# EAGLE design 4x4_numpad (EAGLE 8.2.2)
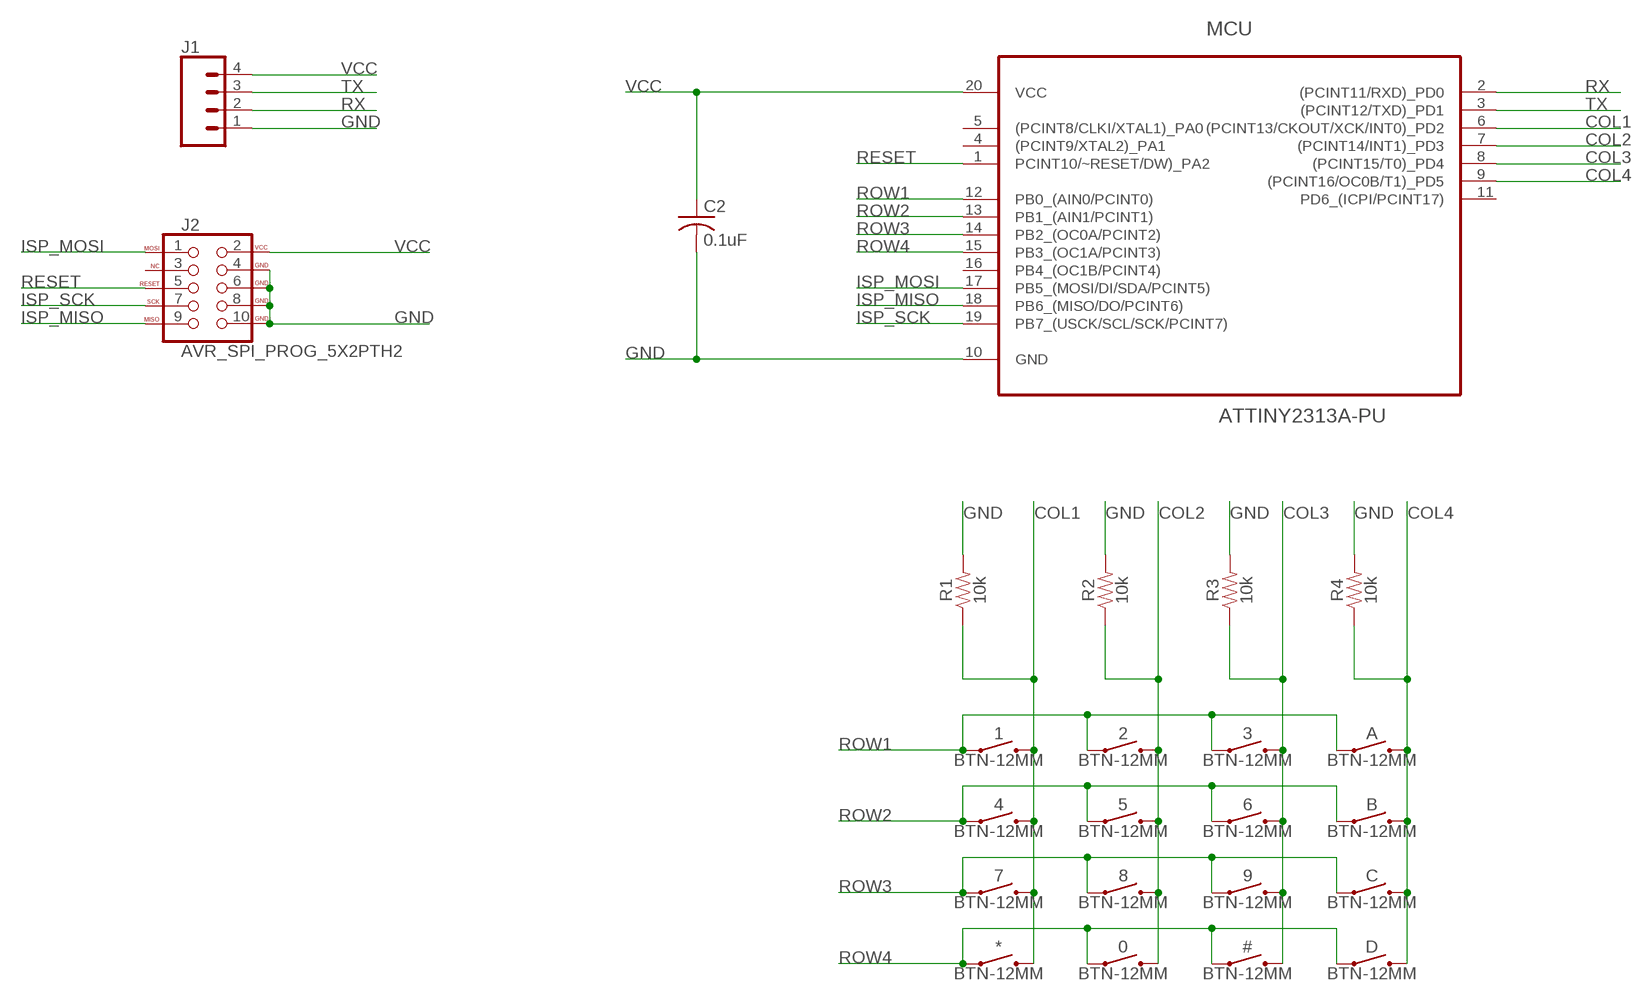
[diagram p0: schematic, sheet 1]

## Parts
0  BTN-12MM  MOMENTARY-SWITCH-SPST-PTH-12MM  [TACTILE_SWITCH_PTH_12MM]
1  BTN-12MM  MOMENTARY-SWITCH-SPST-PTH-12MM  [TACTILE_SWITCH_PTH_12MM]
2  BTN-12MM  MOMENTARY-SWITCH-SPST-PTH-12MM  [TACTILE_SWITCH_PTH_12MM]
3  BTN-12MM  MOMENTARY-SWITCH-SPST-PTH-12MM  [TACTILE_SWITCH_PTH_12MM]
4  BTN-12MM  MOMENTARY-SWITCH-SPST-PTH-12MM  [TACTILE_SWITCH_PTH_12MM]
5  BTN-12MM  MOMENTARY-SWITCH-SPST-PTH-12MM  [TACTILE_SWITCH_PTH_12MM]
6  BTN-12MM  MOMENTARY-SWITCH-SPST-PTH-12MM  [TACTILE_SWITCH_PTH_12MM]
7  BTN-12MM  MOMENTARY-SWITCH-SPST-PTH-12MM  [TACTILE_SWITCH_PTH_12MM]
8  BTN-12MM  MOMENTARY-SWITCH-SPST-PTH-12MM  [TACTILE_SWITCH_PTH_12MM]
9  BTN-12MM  MOMENTARY-SWITCH-SPST-PTH-12MM  [TACTILE_SWITCH_PTH_12MM]
#  BTN-12MM  MOMENTARY-SWITCH-SPST-PTH-12MM  [TACTILE_SWITCH_PTH_12MM]
*  BTN-12MM  MOMENTARY-SWITCH-SPST-PTH-12MM  [TACTILE_SWITCH_PTH_12MM]
A  BTN-12MM  MOMENTARY-SWITCH-SPST-PTH-12MM  [TACTILE_SWITCH_PTH_12MM]
B  BTN-12MM  MOMENTARY-SWITCH-SPST-PTH-12MM  [TACTILE_SWITCH_PTH_12MM]
C  BTN-12MM  MOMENTARY-SWITCH-SPST-PTH-12MM  [TACTILE_SWITCH_PTH_12MM]
C2  0.1uF  C-US050-025X075  [C050-025X075]
D  BTN-12MM  MOMENTARY-SWITCH-SPST-PTH-12MM  [TACTILE_SWITCH_PTH_12MM]
J1  CONN_04  [1X04]
J2  AVR_SPI_PROG_5X2PTH2  [2X5-SHROUDED]
MCU  ATTINY2313A-PU  [DIP254P762X533-20]
R1  10k  10KOHM-HORIZ-1/4W-1%  [AXIAL-0.3]
R2  10k  10KOHM-HORIZ-1/4W-1%  [AXIAL-0.3]
R3  10k  10KOHM-HORIZ-1/4W-1%  [AXIAL-0.3]
R4  10k  10KOHM-HORIZ-1/4W-1%  [AXIAL-0.3]

## Nets
COL1: 1.3 1.4 4.3 4.4 7.3 7.4 *.3 *.4 MCU.6((PCINT13/CKOUT/XCK/INT0)_PD2) R1.P$1
COL2: 0.3 0.4 2.3 2.4 5.3 5.4 8.3 8.4 MCU.7((PCINT14/INT1)_PD3) R2.P$1
COL3: 3.3 3.4 6.3 6.4 9.3 9.4 #.3 #.4 MCU.8((PCINT15/T0)_PD4) R3.P$1
COL4: A.3 A.4 B.3 B.4 C.3 C.4 D.3 D.4 MCU.9((PCINT16/OC0B/T1)_PD5) R4.P$1
GND: C2.2 J1.1 J2.4(GND) J2.6(GND) J2.8(GND) J2.10(GND) MCU.10(GND) R1.P$2 R2.P$2 R3.P$2 R4.P$2
ISP_MISO: J2.9(MISO) MCU.18(PB6_(MISO/DO/PCINT6))
ISP_MOSI: J2.1(MOSI) MCU.17(PB5_(MOSI/DI/SDA/PCINT5))
ISP_SCK: J2.7(SCK) MCU.19(PB7_(USCK/SCL/SCK/PCINT7))
RESET: J2.5(RESET) MCU.1(PCINT10/~RESET/DW)_PA2)
ROW1: 1.1 1.2 2.1 2.2 3.1 3.2 A.1 A.2 MCU.12(PB0_(AIN0/PCINT0))
ROW2: 4.1 4.2 5.1 5.2 6.1 6.2 B.1 B.2 MCU.13(PB1_(AIN1/PCINT1))
ROW3: 7.1 7.2 8.1 8.2 9.1 9.2 C.1 C.2 MCU.14(PB2_(OC0A/PCINT2))
ROW4: 0.1 0.2 #.1 #.2 *.1 *.2 D.1 D.2 MCU.15(PB3_(OC1A/PCINT3))
RX: J1.2 MCU.2((PCINT11/RXD)_PD0)
TX: J1.3 MCU.3((PCINT12/TXD)_PD1)
VCC: C2.1 J1.4 J2.2(VCC) MCU.20(VCC)
Unconnected: J2.3(NC) MCU.4((PCINT9/XTAL2)_PA1) MCU.5((PCINT8/CLKI/XTAL1)_PA0) MCU.11(PD6_(ICPI/PCINT17)) MCU.16(PB4_(OC1B/PCINT4))

## Library data of the parts
0 1-9 # * A B C D = SparkFun-Switches:MOMENTARY-SWITCH-SPST: Momentary Switch (Pushbutton) - SPST Normally-open (NO) SPST momentary switches (buttons, pushbuttons). Variants PTH-12MM - 12mm square, through-hole Momentary Pushbutton Switch - 12mm Square <https://www.sparkfun.com/products/9190> (COM-09190) PTH-6.0MM, PTH-6.0MM-KIT - 6.0mm square, through-hole Mini Pushbutton Switch <https://www.sparkfun.com/products/97> (COM-00097) KIT package intended for soldering kit's - only one side of pads' copper is exposed. PTH-RIGHT-ANGLE-KIT - Right-angle, through-hole Right Angle Tactile Button <https://www.sparkfun.com/products/10791> - Used on SparkFun BigTime Watch Kit <https://www.sparkfun.com/products/11734> SMD-12MM - 12mm square, surface-mount Tactile Button - SMD (12mm) <https://www.sparkfun.com/products/12993> (COM-12993) Used on SparkFun PicoBoard <https://www.sparkfun.com/products/11888> SMD-4.5MM - 4.5mm Square Trackball Switch Used on SparkFun Blackberry Trackballer Breakout <https://www.sparkfun.com/products/13169> SMD-4.6MMX2.8MM - 4.60mm x 2.80mm, surface mount Used on SparkFun SAMD21 Mini Breakout <https://www.sparkfun.com/products/13664> SMD-5.2MM, SMD-5.2-REDUNDANT - 5.2mm square, surface-mount Mini Pushbutton Switch - SMD <https://www.sparkfun.com/products/8720> (COM-08720) Used on Arduino Pro Mini <https://www.sparkfun.com/products/11114> REDUNDANT package connects both switch circuits together SMD-6.0X3.5MM - 6.0 x 3.5mm, surface mount Momentary Reset Switch SMD <https://www.sparkfun.com/products/8229> (COM-08229) SMD-6.2MM-TALL - 6.2mm square, surface mount Tactile Button - SMD (6mm) <https://www.sparkfun.com/products/12992> Used on SparkFun Digital Sandbox <https://www.sparkfun.com/products/12651> SMD-RIGHT-ANGLE - Right-angle, surface mount Used on SparkFun Block for Intel® Edison - Arduino <https://www.sparkfun.com/products/13036>; PROD_ID: SWCH-09185; SF_SKU: COM-09190
C2 = resistor:C-US: CAPACITOR, American symbol
J1 = SparkFun-Connectors:CONN_04: Multi connection point. Often used as Generic Header-pin footprint for 0.1 inch spaced/style header connections On any of the 0.1 inch spaced packages, you can populate with these: Break Away Headers - Straight <https://www.sparkfun.com/products/116> (PRT-00116) Break Away Male Headers - Right Angle <https://www.sparkfun.com/products/553> (PRT-00553) Female Headers <https://www.sparkfun.com/products/115> (PRT-00115) Break Away Headers - Machine Pin <https://www.sparkfun.com/products/117> (PRT-00117) Break Away Female Headers - Swiss Machine Pin <https://www.sparkfun.com/products/743> (PRT-00743) For SCREWTERMINALS and SPRING TERMINALS visit here: Screw Terimnals on SparkFun.com <https://www.sparkfun.com/search/results?term=Screw+Terminals> (5mm/3.5mm/2.54mm spacing) This device is also useful as a general connection point to wire up your design to another part of your project. Our various solder wires solder well into these plated through hole pads. Hook-Up Wire - Assortment (Stranded, 22 AWG) <https://www.sparkfun.com/products/11375> (PRT-11375) Hook-Up Wire - Assortment (Solid Core, 22 AWG) <https://www.sparkfun.com/products/11367> (PRT-11367) View the entire wire category on our website here <https://www.sparkfun.com/categories/141> Special notes: Molex polarized connector foot print use with SKU : PRT-08231 with associated crimp pins and housings. 1MM SMD Version SKU: PRT-10208; PROD_ID: CONN-09696
J2 = SparkFun-Connectors:AVR_SPI_PROG_5X2: AVR 10-pin ICSP Header This is the standard AVR In Circuit Serial Programming header. Minimal, but includes pin one indicator. Works with standard Olimex programmers. SparkFun Products: 2x5 AVR ICSP Male Header <https://www.sparkfun.com/products/778> - PTH 2x5 Pin Shrouded Header <https://www.sparkfun.com/products/8506> - PTH2; PROD_ID: CONN-08671; SF_ID: PRT-08506
MCU = Atmel_By_element14_Batch_1-00:ATTINY2313A-PU: 8-bit Microcontroller; DESCRIPTION: 8-bit Microcontroller; MPN: ATTINY2313A-PU; OC_FARNELL: 1841616; OC_NEWARK: 12T1333; PACKAGE: DIP-20; SUPPLIER: Atmel
R1-R4 = SparkFun-Resistors:10KOHM: 10kΩ resistor A resistor is a passive two-terminal electrical component that implements electrical resistance as a circuit element. Resistors act to reduce current flow, and, at the same time, act to lower voltage levels within circuits. - Wikipedia; PROD_ID: RES-12183

## Board
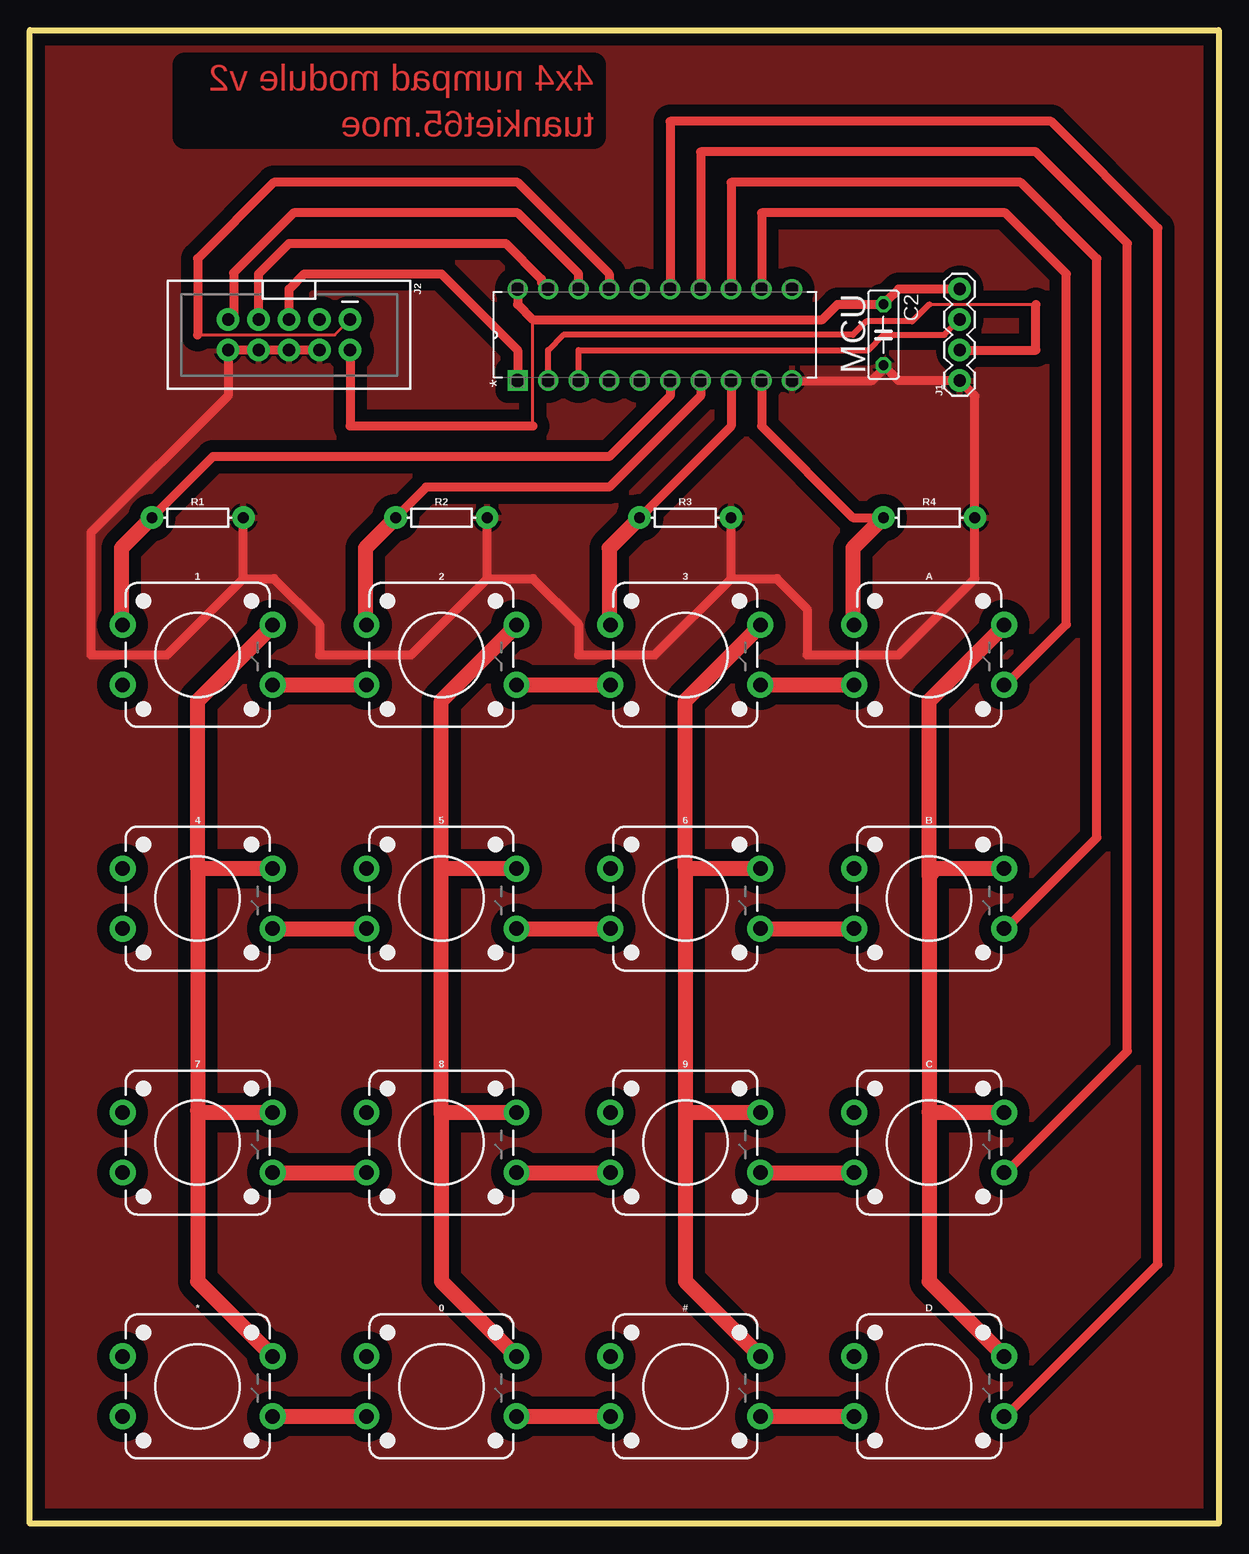
[diagram p1: board, top side]
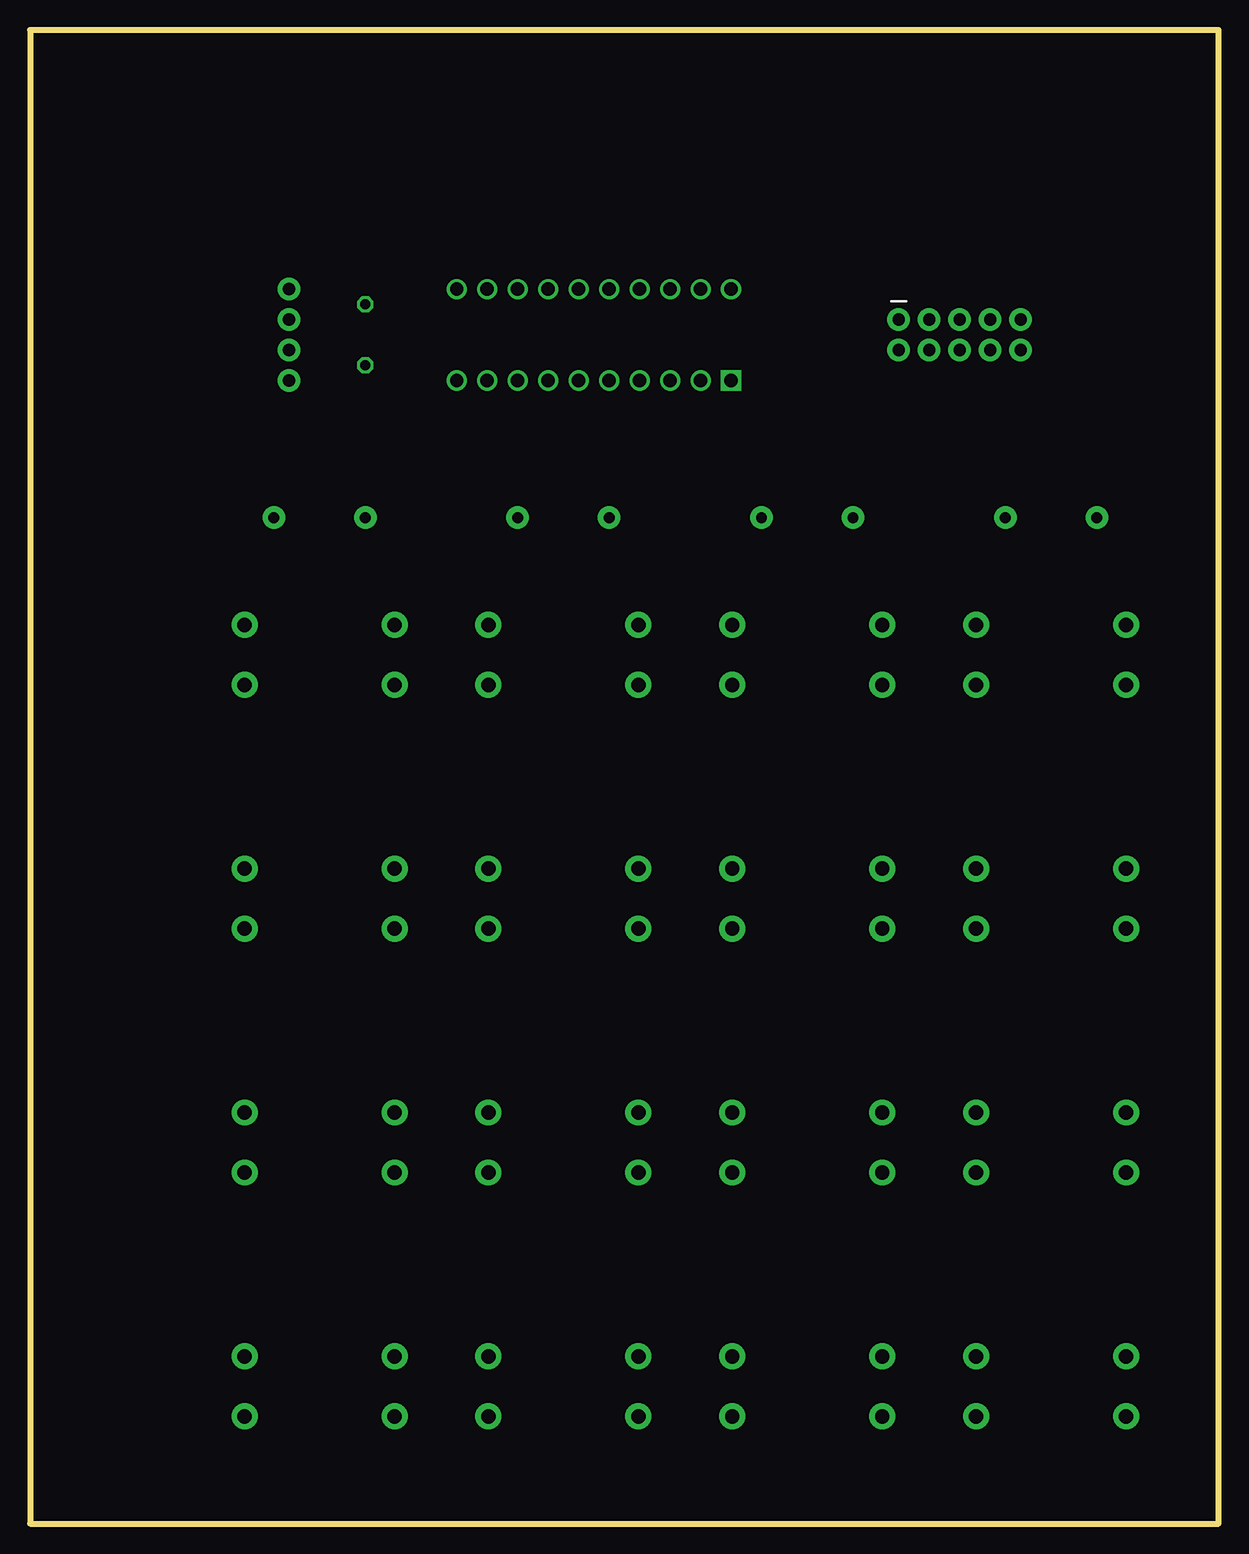
[diagram p2: board, bottom side, seen from below]

Size 99.06 x 124.46 mm. Coordinates in mm from the lower left corner, seen from the top.
Outline: 99.06,124.46 99.06,0 0,0 0,124.46 99.06,124.46
Copper layers (1*16): Top 0.035mm / dielectric 1.5mm / Bottom 0.035mm
Design rules "default *": minimum track width 20mil, minimum drill 0.35mm, track to track 20mil, track to pad 20mil, pad to pad 20mil, via to via 6mil, smd to smd 6mil, copper to edge 40mil, drill to drill 6mil, minimum pad ring 10mil, minimum via ring 8mil, stop-mask expansion 4mil, vias tented up to drill 0mil, thermal gap 10mil

### Footprints (pad centres in the part's own frame; a part is rotated, then mirrored left to right if it is on the bottom)
TACTILE_SWITCH_PTH_12MM = drill 1.2 pad 2.159: 1 6.25,-2.5; 2 -6.25,-2.5; 3 6.25,2.5; 4 -6.25,2.5
C050-025X075 = drill 0.813 octagon: 1 -2.54,0; 2 2.54,0
1X04 = drill 1.016 pad 1.88: 1 0,0; 2 2.54,0; 3 5.08,0; 4 7.62,0
2X5-SHROUDED = drill 1.016 pad 1.88: 1 -1.27,5.08; 2 1.27,5.08; 3 -1.27,2.54; 4 1.27,2.54; 5 -1.27,0; 6 1.27,0; 7 -1.27,-2.54; 8 1.27,-2.54; 9 -1.27,-5.08; 10 1.27,-5.08
DIP254P762X533-20 = drill 1.118 square: 1 -7.62,22.86 | drill 1.118: 2 -7.62,20.32; 3 -7.62,17.78; 4 -7.62,15.24; 5 -7.62,12.7; 6 -7.62,10.16; 7 -7.62,7.62; 8 -7.62,5.08; 9 -7.62,2.54; 10 -7.62,0; 11 0,0; 12 0,2.54; 13 0,5.08; 14 0,7.62; 15 0,10.16; 16 0,12.7; 17 0,15.24; 18 0,17.78; 19 0,20.32; 20 0,22.86
AXIAL-0.3 = drill 0.9 pad 1.88: P$1 -3.81,0; P$2 3.81,0

### Placement (x,y rotation side)
0  34.29,11.43 0 top
1  13.97,72.39 0 top
2  34.29,72.39 0 top
3  54.61,72.39 0 top
4  13.97,52.07 0 top
5  34.29,52.07 0 top
6  54.61,52.07 0 top
7  13.97,31.75 0 top
8  34.29,31.75 0 top
9  54.61,31.75 0 top
#  54.61,11.43 0 top
*  13.97,11.43 0 top
A  74.93,72.39 0 top
B  74.93,52.07 0 top
C  74.93,31.75 0 top
C2  71.12,99.06 270 top
D  74.93,11.43 0 top
J1  77.47,95.25 90 top
J2  21.59,99.06 270 top
MCU  63.5,102.87 90 top
R1  13.97,83.82 0 top
R2  34.29,83.82 0 top
R3  54.61,83.82 0 top
R4  74.93,83.82 0 top

### Tracks (layer width: path | path; a pad name or v marks a point on that pad's centre or on a via)
COL1
  Top 0.762: MCU.6 53.34,93.98 48.26,88.9 15.24,88.9 R1.P$1
  Top 1.27: R1.P$1 7.62,81.28 7.62,74.99 1.4 | 1.3 20.22,74.83 13.97,68.58 13.97,54.61 | 13.97,54.61 13.97,34.41 | 13.97,34.41 13.97,20.18 *.3 | 7.3 14.12,34.25 13.97,34.41 | 4.3 14.01,54.57 13.97,54.61
COL2
  Top 0.508: 28.19,34.29 8.4
  Top 0.762: MCU.7 55.88,93.98 48.26,86.36 33.02,86.36 R2.P$1
  Top 1.27: R2.P$1 27.94,81.28 27.94,74.99 2.4 | 2.3 40.54,74.83 34.29,68.58 34.29,54.61 | 34.29,34.03 34.29,54.61 | 34.29,34.03 34.29,20.18 0.3 | 5.3 34.33,54.57 34.29,54.61 | 8.3 34.51,34.25 34.29,34.03
COL3
  Top 0.762: MCU.8 58.42,91.44 R3.P$1
  Top 1.27: 3.3 60.86,74.83 54.61,68.58 54.61,54.61 | 54.61,54.61 54.61,34.29 | 54.61,34.29 54.61,20.18 #.3 | 9.3 54.65,34.25 54.61,34.29 | 6.3 54.65,54.57 54.61,54.61 | R3.P$1 48.26,81.28 48.26,74.99 3.4
COL4
  Top 0.762: MCU.9 60.96,91.44 68.58,83.82 R4.P$1
  Top 1.27: A.3 81.18,74.83 74.93,68.58 74.93,54 | 74.93,54 74.93,34.29 | 74.93,34.29 74.93,20.18 D.3 | C.3 74.97,34.25 74.93,34.29 | B.3 75.5,54.57 74.93,54 | A.4 68.58,74.99 68.58,81.28 R4.P$1
GND
  Top 0.762: J2.4 J2.6 J2.8 J2.10 16.51,93.98 5.08,82.55 5.08,72.39 11.43,72.39 17.78,78.74 | 17.78,78.74 R1.P$2 | 17.78,78.74 20.32,78.74 24.13,74.93 24.13,72.39 31.75,72.39 38.1,78.74 | 38.1,78.74 R2.P$2 | 38.1,78.74 41.91,78.74 45.72,74.93 45.72,72.39 52.07,72.39 58.42,78.74 | 58.42,78.74 R3.P$2 | 58.42,78.74 62.23,78.74 64.77,76.2 64.77,72.39 72.39,72.39 78.74,78.74 R4.P$2 78.74,93.98 J1.1 72.39,95.25 71.28,96.36 | 71.28,96.36 C2.2 | MCU.10 70.16,95.25 71.28,96.36
  pour Top (isolate 1.016): 0,124.46 99.06,124.46 99.06,0 0,0
ISP_MISO
  Top 0.762: MCU.18 45.72,104.14 40.64,109.22 21.98,109.22 16.97,104.21 16.97,100.79 J2.9
ISP_MOSI
  Top 0.254: 13.97,99.06 25.4,99.06 J2.1
  Top 0.762: MCU.17 48.26,104.14 40.64,111.76 20.32,111.76 13.97,105.41 13.97,99.06
ISP_SCK
  Top 0.762: J2.7 19.05,104.14 21.59,106.68 39.63,106.68 42.62,103.69 42.62,103.43 MCU.19
RESET
  Top 0.762: J2.5 21.59,102.87 22.86,104.14 34.29,104.14 40.64,97.79 MCU.1
ROW1
  Top 0.762: A.1 81.32,69.89 86.36,74.93 86.36,104.14 81.28,109.22 60.96,109.22 MCU.12
  Top 1.27: 3.1 A.2 | 2.1 3.2 | 1.1 2.2
ROW2
  Top 0.762: B.1 81.32,49.57 88.9,57.15 88.9,105.41 82.55,111.76 58.42,111.76 MCU.13
  Top 1.27: 4.1 5.2 | 5.1 6.2 | 6.1 B.2
ROW3
  Top 0.762: C.1 81.32,29.25 91.44,39.37 91.44,106.68 83.82,114.3 55.88,114.3 MCU.14
  Top 1.27: 7.1 8.2 | 8.1 9.2 | 9.1 C.2
ROW4
  Top 0.762: D.1 81.32,8.93 93.98,21.59 93.98,107.95 85.09,116.84 53.34,116.84 MCU.15
  Top 1.27: *.1 0.2 | 0.1 #.2 | #.1 D.2
RX
  Top 0.254: 74.93,101.6 74.94,101.6 83.82,101.6
  Top 0.508: MCU.2 43.18,97.79 44.45,99.06 68.58,99.06 69.7,100.18 73.52,100.18 74.94,101.6
  Top 0.762: J1.2 83.82,97.79 83.82,101.6
TX
  Top 0.508: MCU.3 45.72,97.79 69.85,97.79 71.12,99.06 76.2,99.06 J1.3
VCC
  Top 0.254: 41.91,91.44 41.91,100.33
  Top 0.762: J2.2 26.67,91.44 41.91,91.44 | MCU.20 40.64,101.6 41.91,100.33 66.04,100.33 67.31,101.6 C2.1 | J1.4 72.39,102.87 71.32,101.8 | 71.32,101.8 C2.1 | C2.1 71.32,101.8

### Text on the board
Top: 4x4 numpad module v2 / tuankiet65.moe